# EAGLE schematic counter_module (EAGLE 9.6.0)
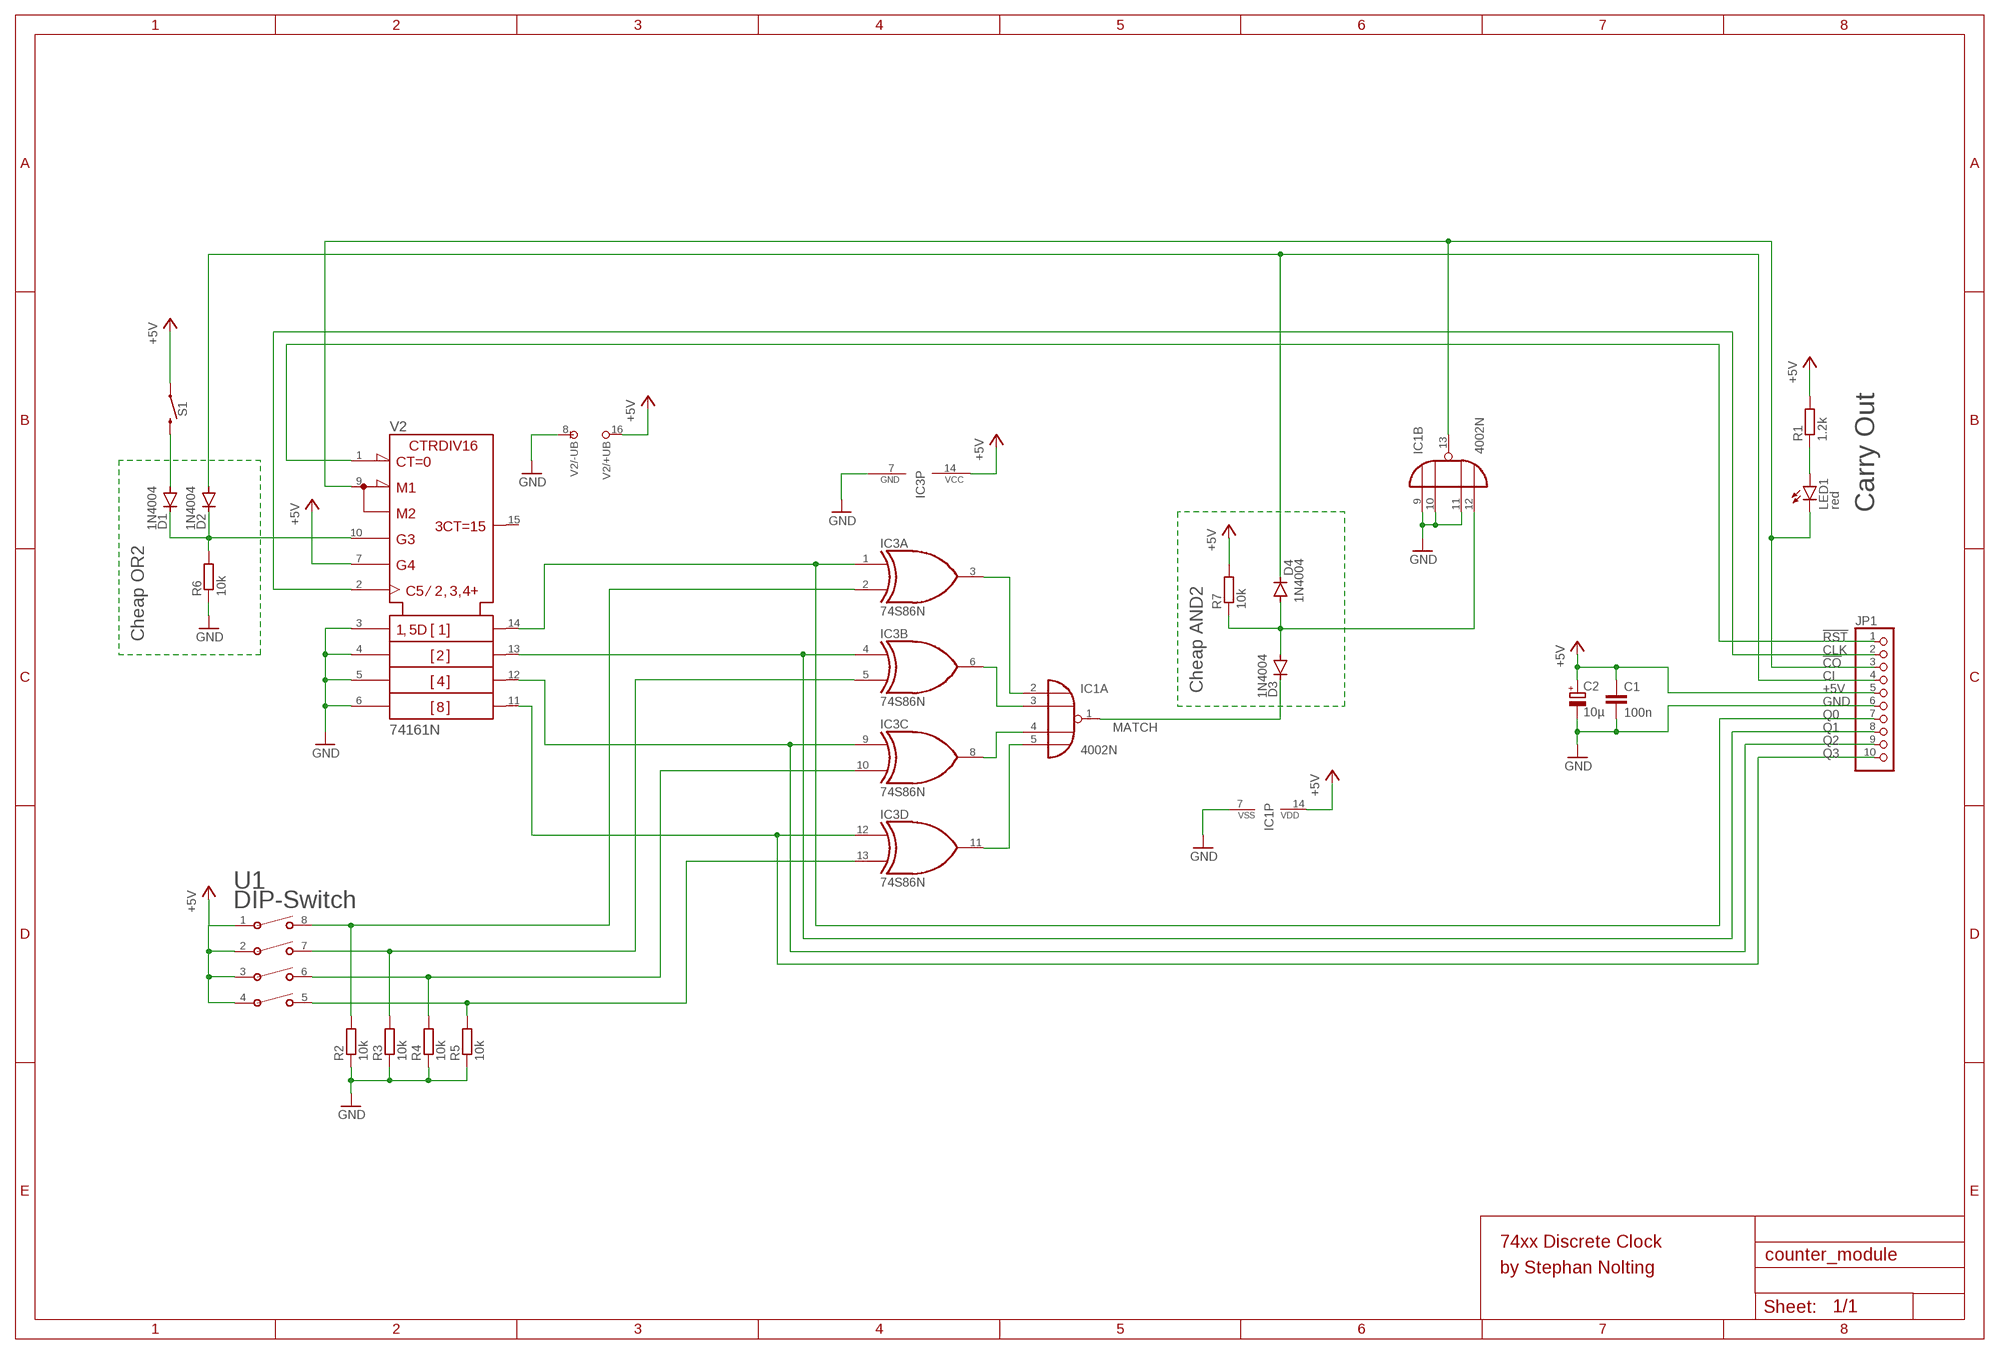
[diagram p0: schematic, sheet 1]

## Parts
C1  100n  C-EU025-024X044  [C025-024X044]
C2  10µ  CPOL-EUE2-5  [E2-5]
D1  1N4004  [DO-41]
D2  1N4004  [DO-41]
D3  1N4004  [DO-41]
D4  1N4004  [DO-41]
IC1  4002N  [DIL14]
IC3  74S86N  [DIL14]
JP1  PINHD-1X10/90  [1X10/90]
LED1  red  LED3MM  [LED3MM]
R1  1.2k  R-EU_0204/7  [0204/7]
R2  10k  R-EU_0204/7  [0204/7]
R3  10k  R-EU_0204/7  [0204/7]
R4  10k  R-EU_0204/7  [0204/7]
R5  10k  R-EU_0204/7  [0204/7]
R6  10k  R-EU_0204/7  [0204/7]
R7  10k  R-EU_0204/7  [0204/7]
S1  MOMENTARY-SWITCH-SPST-PTH-RIGHT-ANGLE-KIT  [TACTILE_SWITCH_PTH_RIGHT_ANGLE_KIT]
U1  DIP-Switch  3-5435640-5  [SWDIP8_315X360P100]
V2  74161N  [DIL16]

## Nets
!CO: IC1.13(B:O) JP1.3 LED1.K(C) V2.9(!LOAD)
!RST: JP1.1 V2.1(!CLR)
+5V: C1.1 C2.+ IC1.14(P:VDD) IC3.14(P:VCC) JP1.5 R1.2 R7.2 S1.1 U1.1 U1.2 U1.3 U1.4 V2.7(ENP) V2.16(+UB)
CI: D2.A D4.C JP1.4
CLK: JP1.2 V2.2(CLK)
GND: C1.2 C2.- IC1.7(P:VSS) IC1.9(B:I0) IC1.10(B:I1) IC1.11(B:I2) IC3.7(P:GND) JP1.6 R2.1 R3.1 R4.1 R5.1 R6.1 V2.3(A) V2.4(B) V2.5(C) V2.6(D) V2.8(-UB)
MATCH: D3.C IC1.1(A:O)
N$1: IC1.3(A:I1) IC3.6(B:O)
N$2: IC1.4(A:I2) IC3.8(C:O)
N$3: IC1.5(A:I3) IC3.11(D:O)
N$4: IC1.2(A:I0) IC3.3(A:O)
N$6: IC3.2(A:I1) R2.2 U1.8
N$8: IC3.5(B:I1) R3.2 U1.7
N$11: IC3.10(C:I1) R4.2 U1.6
N$12: IC3.13(D:I1) R5.2 U1.5
N$13: D1.C D2.C R6.2 V2.10(ENT)
N$14: D1.A S1.2
N$15: LED1.A R1.1
N$17: D3.A D4.A IC1.12(B:I3) R7.1
Q0: IC3.1(A:I0) JP1.7 V2.14(QA)
Q1: IC3.4(B:I0) JP1.8 V2.13(QB)
Q2: IC3.9(C:I0) JP1.9 V2.12(QC)
Q3: IC3.12(D:I0) JP1.10 V2.11(QD)
Unconnected: V2.15(RCO)

## Notes on the sheet
- Carry Out
- Cheap OR2
- Cheap AND2
- 74xx Discrete Clock
- by Stephan Nolting

## Library data of the parts
C1 = rcl:C-EU: CAPACITOR, European symbol; SPICEPREFIX: C
C2 = rcl:CPOL-EU: POLARIZED CAPACITOR, European symbol; SPICEPREFIX: C
D1-D4 = Diodes:1N4004: DIODE GEN PURP 400V 1A DO41 Manufacturer's datasheet <https://www.mccsemi.com/pdf/Products/1N4001-1N4007(DO-41).pdf>; CREATED_BY: PCBLayout.com; DIGIKEY_PART_NUMBER: 1N4004MSCT-ND; MANUFACTURER: Micro Commercial Co; MPN: 1N4004; PACKAGE: DO-41
IC1 = 40xx:4002: 4-input NOR
IC3 = 74xx-us:74*86: Quad 2-input EXCLUSIV-OR (XOR) gate
JP1 = pinhead:PINHD-1X10: PIN HEADER
LED1 = led:LED: LED OSRAM: - CHIPLED LG R971, LG N971, LY N971, LG Q971, LY Q971, LO R971, LY R971 LH N974, LH R974 LS Q976, LO Q976, LY Q976 LO Q996 - Hyper CHIPLED LW Q18S LB Q993, LB Q99A, LB R99A - SideLED LS A670, LO A670, LY A670, LG A670, LP A670 LB A673, LV A673, LT A673, LW A673 LH A674 LY A675 LS A676, LA A676, LO A676, LY A676, LW A676 LS A679, LY A679, LG A679 - Hyper Micro SIDELED® LS Y876, LA Y876, LO Y876, LY Y876 LT Y87S - SmartLED LW L88C, LW L88S LB L89C, LB L89S, LG L890 LS L89K, LO L89K, LY L89K LS L896, LA L896, LO L896, LY L896 - TOPLED LS T670, LO T670, LY T670, LG T670, LP T670 LSG T670, LSP T670, LSY T670, LOP T670, LYG T670 LG T671, LOG T671, LSG T671 LB T673, LV T673, LT T673, LW T673 LH T674 LS T676, LA T676, LO T676, LY T676, LB T676, LH T676, LSB T676, LW T676 LB T67C, LV T67C, LT T67C, LS T67K, LO T67K, LY T67K, LW E67C LS E67B, LA E67B, LO E67B, LY E67B, LB E67C, LV E67C, LT E67C LW T67C LS T679, LY T679, LG T679 LS T770, LO T770, LY T770, LG T770, LP T770 LB T773, LV T773, LT T773, LW T773 LH T774 LS E675, LA E675, LY E675, LS T675 LS T776, LA T776, LO T776, LY T776, LB T776 LHGB T686 LT T68C, LB T68C - Hyper Mini TOPLED® LB M676 - Mini TOPLED Santana® LG M470 LS M47K, LO M47K, LY M47K Source: http://www.osram.convergy.de LUXEON: - LUMILED® LXK2-PW12-R00, LXK2-PW12-S00, LXK2-PW14-U00, LXK2-PW14-V00 LXK2-PM12-R00, LXK2-PM12-S00, LXK2-PM14-U00 LXK2-PE12-Q00, LXK2-PE12-R00, LXK2-PE12-S00, LXK2-PE14-T00, LXK2-PE14-U00 LXK2-PB12-K00, LXK2-PB12-L00, LXK2-PB12-M00, LXK2-PB14-N00, LXK2-PB14-P00, LXK2-PB14-Q00 LXK2-PR12-L00, LXK2-PR12-M00, LXK2-PR14-Q00, LXK2-PR14-R00 LXK2-PD12-Q00, LXK2-PD12-R00, LXK2-PD12-S00 LXK2-PH12-R00, LXK2-PH12-S00 LXK2-PL12-P00, LXK2-PL12-Q00, LXK2-PL12-R00 Source: www.luxeon.com KINGBRIGHT: KA-3528ASYC Source: www.kingbright.com
R1-R7 = rcl:R-EU_: RESISTOR, European symbol; SPICEPREFIX: R
S1 = SparkFun-Switches:MOMENTARY-SWITCH-SPST: Momentary Switch (Pushbutton) - SPST Normally-open (NO) SPST momentary switches (buttons, pushbuttons). Variants PTH-12MM - 12mm square, through-hole Momentary Pushbutton Switch - 12mm Square <https://www.sparkfun.com/products/9190> (COM-09190) PTH-6.0MM, PTH-6.0MM-KIT - 6.0mm square, through-hole Mini Pushbutton Switch <https://www.sparkfun.com/products/97> (COM-00097) KIT package intended for soldering kit's - only one side of pads' copper is exposed. PTH-RIGHT-ANGLE-KIT - Right-angle, through-hole Right Angle Tactile Button <https://www.sparkfun.com/products/10791> - Used on SparkFun BigTime Watch Kit <https://www.sparkfun.com/products/11734> SMD-12MM - 12mm square, surface-mount Tactile Button - SMD (12mm) <https://www.sparkfun.com/products/12993> (COM-12993) Used on SparkFun PicoBoard <https://www.sparkfun.com/products/11888> SMD-4.5MM - 4.5mm Square Trackball Switch Used on SparkFun Blackberry Trackballer Breakout <https://www.sparkfun.com/products/13169> SMD-4.6MMX2.8MM - 4.60mm x 2.80mm, surface mount Used on SparkFun SAMD21 Mini Breakout <https://www.sparkfun.com/products/13664> SMD-5.2MM, SMD-5.2-REDUNDANT - 5.2mm square, surface-mount Mini Pushbutton Switch - SMD <https://www.sparkfun.com/products/8720> (COM-08720) Used on Arduino Pro Mini <https://www.sparkfun.com/products/11114> REDUNDANT package connects both switch circuits together SMD-6.0X3.5MM - 6.0 x 3.5mm, surface mount Momentary Reset Switch SMD <https://www.sparkfun.com/products/8229> (COM-08229) SMD-6.2MM-TALL - 6.2mm square, surface mount Tactile Button - SMD (6mm) <https://www.sparkfun.com/products/12992> Used on SparkFun Digital Sandbox <https://www.sparkfun.com/products/12651> SMD-RIGHT-ANGLE - Right-angle, surface mount Used on SparkFun Block for Intel® Edison - Arduino <https://www.sparkfun.com/products/13036>; PROD_ID: CONN-10672; SF_SKU: COM-10791
U1 = Switches:3-5435640-5; BUILT_BY: EMA_UL_Team; CATEGORY: DIP & SIP Switches; COPYRIGHT: Copyright (C) 2016 Accelerated Designs. All rights reserved; DESCRIPTION: DIP SW 4 POSN SEALED; MANUFACTURER_PART_NUMBER: 3-5435640-5; PART_STATUS: active; SERIES: Alcoswitch 7100; VENDOR: TE Connectivity
V2 = 74ttl-din:74*161: Synchrounus 4-bit COUNTER